# Altium schematic sheet Sheet6.SchDoc
size A4
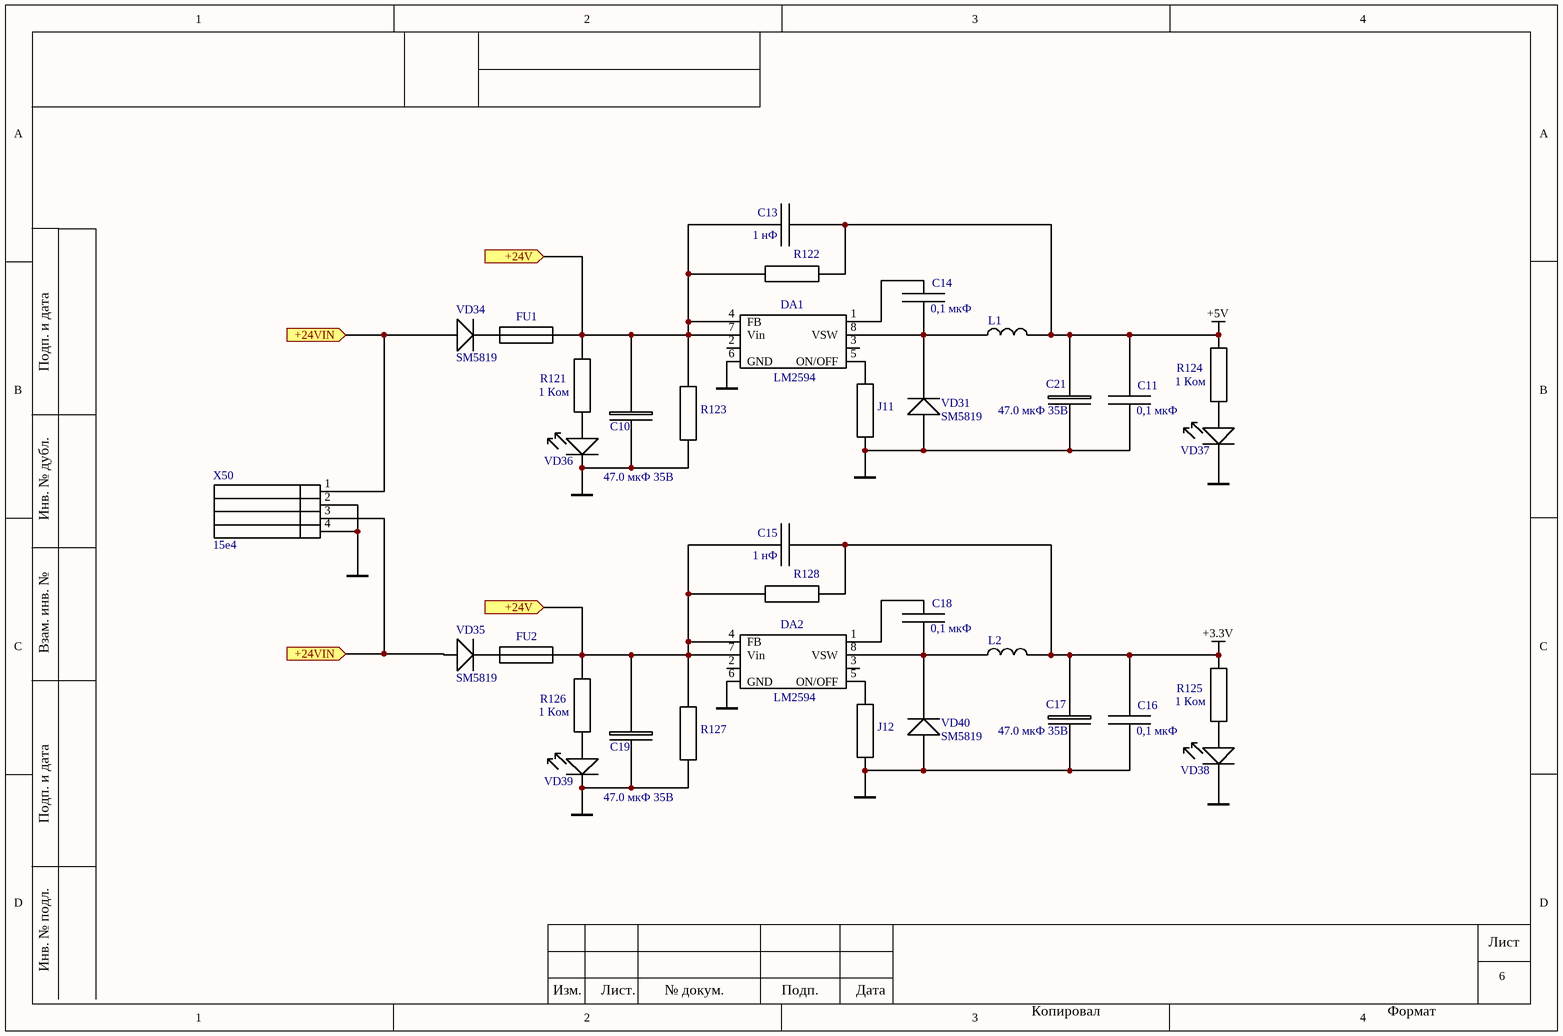
[diagram p0: Sheet6.SchDoc]

## Parts
C10  C_e  (value not drawn)
C11  C0805  (value not drawn)
C13  C0805  (value not drawn)
C14  C0805  (value not drawn)
C15  C0805  (value not drawn)
C16  C0805  (value not drawn)
C17  C_e  (value not drawn)
C18  C0805  (value not drawn)
C19  C_e  (value not drawn)
C21  C_e  (value not drawn)
DA1  LM2594
DA2  LM2594
FU1  FU  (value not drawn)
FU2  FU  (value not drawn)
J11  R0805  (value not drawn)
J12  R0805  (value not drawn)
L1  DR  (value not drawn)
L2  DR  (value not drawn)
R121  R0805  (value not drawn)
R122  R0805  (value not drawn)
R123  R0805  (value not drawn)
R124  R0805  (value not drawn)
R125  R0805  (value not drawn)
R126  R0805  (value not drawn)
R127  R0805  (value not drawn)
R128  R0805  (value not drawn)
VD31  SM5819
VD34  SM5819
VD35  SM5819
VD36  LED  (value not drawn)
VD37  LED  (value not drawn)
VD38  LED  (value not drawn)
VD39  LED  (value not drawn)
VD40  SM5819
X50  15e4

## Ports
+24V, +24VIN

## Nets
+3.3V: C15.2 C16.2 C17.1 L2.2 R125.1 R128.2
+5V: C11.2 C13.2 C21.1 L1.2 R122.2 R124.1
GND: C10.2 C11.1 C16.1 C17.2 C19.2 C21.2 DA1.6(GND) DA2.6(GND) J11.2 J12.2 R123.2 R127.2 VD31.2(K) VD36.1(A) VD37.1(A) VD38.1(A) VD39.1(A) VD40.2(K) X50.2 X50.4
+24V: C10.1 C13.1 C15.1 C19.1 DA1.4(FB) DA1.7(Vin) DA2.4(FB) DA2.7(Vin) FU1.2 FU2.2 R121.1 R122.1 R123.1 R126.1 R127.1 R128.1 ; port +24V
+24VIN: VD34.2(K) VD35.2(K) X50.1 X50.3 ; port +24VIN
NetC14_1: C14.1 DA1.8(VSW) L1.1 VD31.1(A)
NetC14_2: C14.2 DA1.1(CB)
NetC18_1: C18.1 DA2.8(VSW) L2.1 VD40.1(A)
NetC18_2: C18.2 DA2.1(CB)
NetDA1_5: DA1.5(ON/OFF) J11.1
NetDA2_5: DA2.5(ON/OFF) J12.1
NetFU1_1: FU1.1 VD34.1(A)
NetFU2_1: FU2.1 VD35.1(A)
NetR121_2: R121.2 VD36.2(K)
NetR124_2: R124.2 VD37.2(K)
NetR125_2: R125.2 VD38.2(K)
NetR126_2: R126.2 VD39.2(K)

Not connected (* = marked no-connect by the designer): DA1 2 3; DA2 2 3

## Notes on the sheet
- 6
- Подп. и дата
- Инв. № дубл.
- Взам. инв. №
- Инв. № подл.
- Лист
- Изм.
- Лист.
- № докум.
- Подп.
- Дата
- Копировал
- Формат
- (in symbol C0805) 1 нФ; 0,1 мкФ
- (in symbol C_e) 47.0 мкФ 35В
- (in symbol R0805) 1 Ком

## Library data of the parts
VD31 VD34 VD35 VD40 = Diod